# EAGLE design Logic Gates (EAGLE 9.6.2)
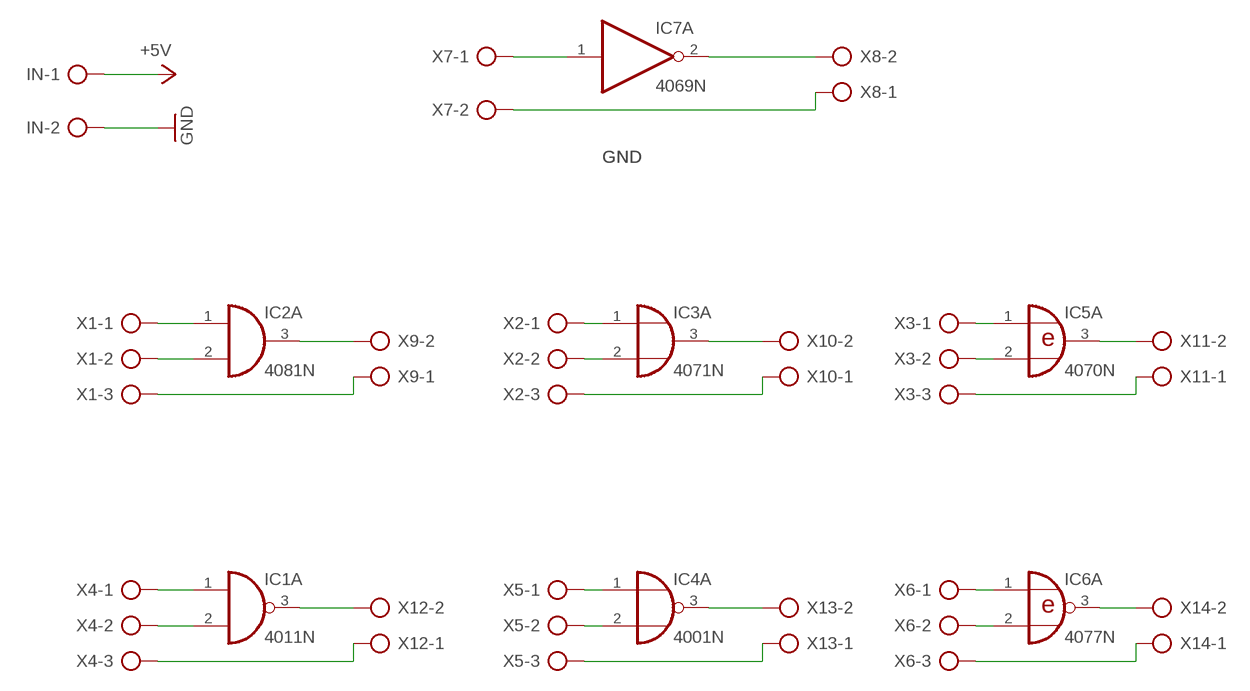
[diagram p0: schematic, sheet 1]

## Parts
IC1  4011N  [DIL14]
IC2  4081N  [DIL14]
IC3  4071N  [DIL14]
IC4  4001N  [DIL14]
IC5  4070N  [DIL14]
IC6  4077N  [DIL14]
IC7  4069N  [DIL14]
IN  AK300/2  [AK300/2]
X1  AK300/3  [AK300/3]
X2  AK300/3  [AK300/3]
X3  AK300/3  [AK300/3]
X4  AK300/3  [AK300/3]
X5  AK300/3  [AK300/3]
X6  AK300/3  [AK300/3]
X7  AK300/2  [AK300/2]
X8  AK300/2  [AK300/2]
X9  AK300/2  [AK300/2]
X10  AK300/2  [AK300/2]
X11  AK300/2  [AK300/2]
X12  AK300/2  [AK300/2]
X13  AK300/2  [AK300/2]
X14  AK300/2  [AK300/2]

## Nets
+5V: IN.1
GND: IN.2 X1.3 X2.3 X3.3 X4.3 X5.3 X6.3 X7.2 X8.1 X9.1 X10.1 X11.1 X12.1 X13.1 X14.1
N$1: IC7.1(A:I) X7.1
N$2: IC7.2(A:O) X8.2
N$4: IC2.1(A:I0) X1.1
N$5: IC2.3(A:O) X9.2
N$6: IC2.2(A:I1) X1.2
N$7: IC3.3(A:O) X10.2
N$8: IC5.3(A:O) X11.2
N$9: IC3.1(A:I0) X2.1
N$10: IC3.2(A:I1) X2.2
N$11: IC6.3(A:O) X14.2
N$12: IC4.3(A:O) X13.2
N$13: IC5.1(A:I0) X3.1
N$14: IC1.3(A:O) X12.2
N$15: IC5.2(A:I1) X3.2
N$18: IC1.1(A:I0) X4.1
N$19: IC1.2(A:I1) X4.2
N$22: IC4.1(A:I0) X5.1
N$23: IC4.2(A:I1) X5.2
N$25: IC6.1(A:I0) X6.1
N$26: IC6.2(A:I1) X6.2
Unconnected: IC1.4(B:O) IC1.5(B:I0) IC1.6(B:I1) IC1.8(C:I0) IC1.9(C:I1) IC1.10(C:O) IC1.11(D:O) IC1.12(D:I0) IC1.13(D:I1) IC2.4(B:O) IC2.5(B:I0) IC2.6(B:I1) IC2.8(C:I0) IC2.9(C:I1) IC2.10(C:O) IC2.11(D:O) IC2.12(D:I0) IC2.13(D:I1) IC3.4(B:O) IC3.5(B:I0) IC3.6(B:I1) IC3.8(C:I0) IC3.9(C:I1) IC3.10(C:O) IC3.11(D:O) IC3.12(D:I0) IC3.13(D:I1) IC4.4(B:O) IC4.5(B:I0) IC4.6(B:I1) IC4.8(C:I0) IC4.9(C:I1) IC4.10(C:O) IC4.11(D:O) IC4.12(D:I0) IC4.13(D:I1) IC5.4(B:O) IC5.5(B:I0) IC5.6(B:I1) IC5.8(C:I0) IC5.9(C:I1) IC5.10(C:O) IC5.11(D:O) IC5.12(D:I0) IC5.13(D:I1) IC6.4(B:O) IC6.5(B:I0) IC6.6(B:I1) IC6.8(C:I0) IC6.9(C:I1) IC6.10(C:O) IC6.11(D:O) IC6.12(D:I0) IC6.13(D:I1) IC7.3(B:I) IC7.4(B:O) IC7.5(C:I) IC7.6(C:O) IC7.8(D:O) IC7.9(D:I) IC7.10(E:O) IC7.11(E:I) IC7.12(F:O) IC7.13(F:I)

## Power pins joined to a net without a drawn wire
+5V: IC1.14(P:VDD) IC2.14(P:VDD) IC3.14(P:VDD) IC4.14(P:VDD) IC5.14(P:VDD) IC6.14(P:VDD) IC7.14(P:VDD)
GND: IC1.7(P:VSS) IC2.7(P:VSS) IC3.7(P:VSS) IC4.7(P:VSS) IC5.7(P:VSS) IC6.7(P:VSS) IC7.7(P:VSS)

## Library data of the parts
IC1 = 40xx:4011: Quad 2-input NAND
IC2 = 40xx:4081: Quad 2-input AND
IC3 = 40xx:4071: Quad 2-input OR
IC4 = 40xx:4001: Quad 2-input NOR
IC5 = 40xx:4070: Quad 2-input XOR
IC6 = 40xx:4077: Quad XNOR
IC7 = 40xx:4069: Hex INVERTER
IN X7-X14 = con-ptr500:AK300/2: CONNECTOR; OC_FARNELL: unknown; OC_NEWARK: unknown
X1-X6 = con-ptr500:AK300/3: CONNECTOR; OC_FARNELL: unknown; OC_NEWARK: unknown

## Board
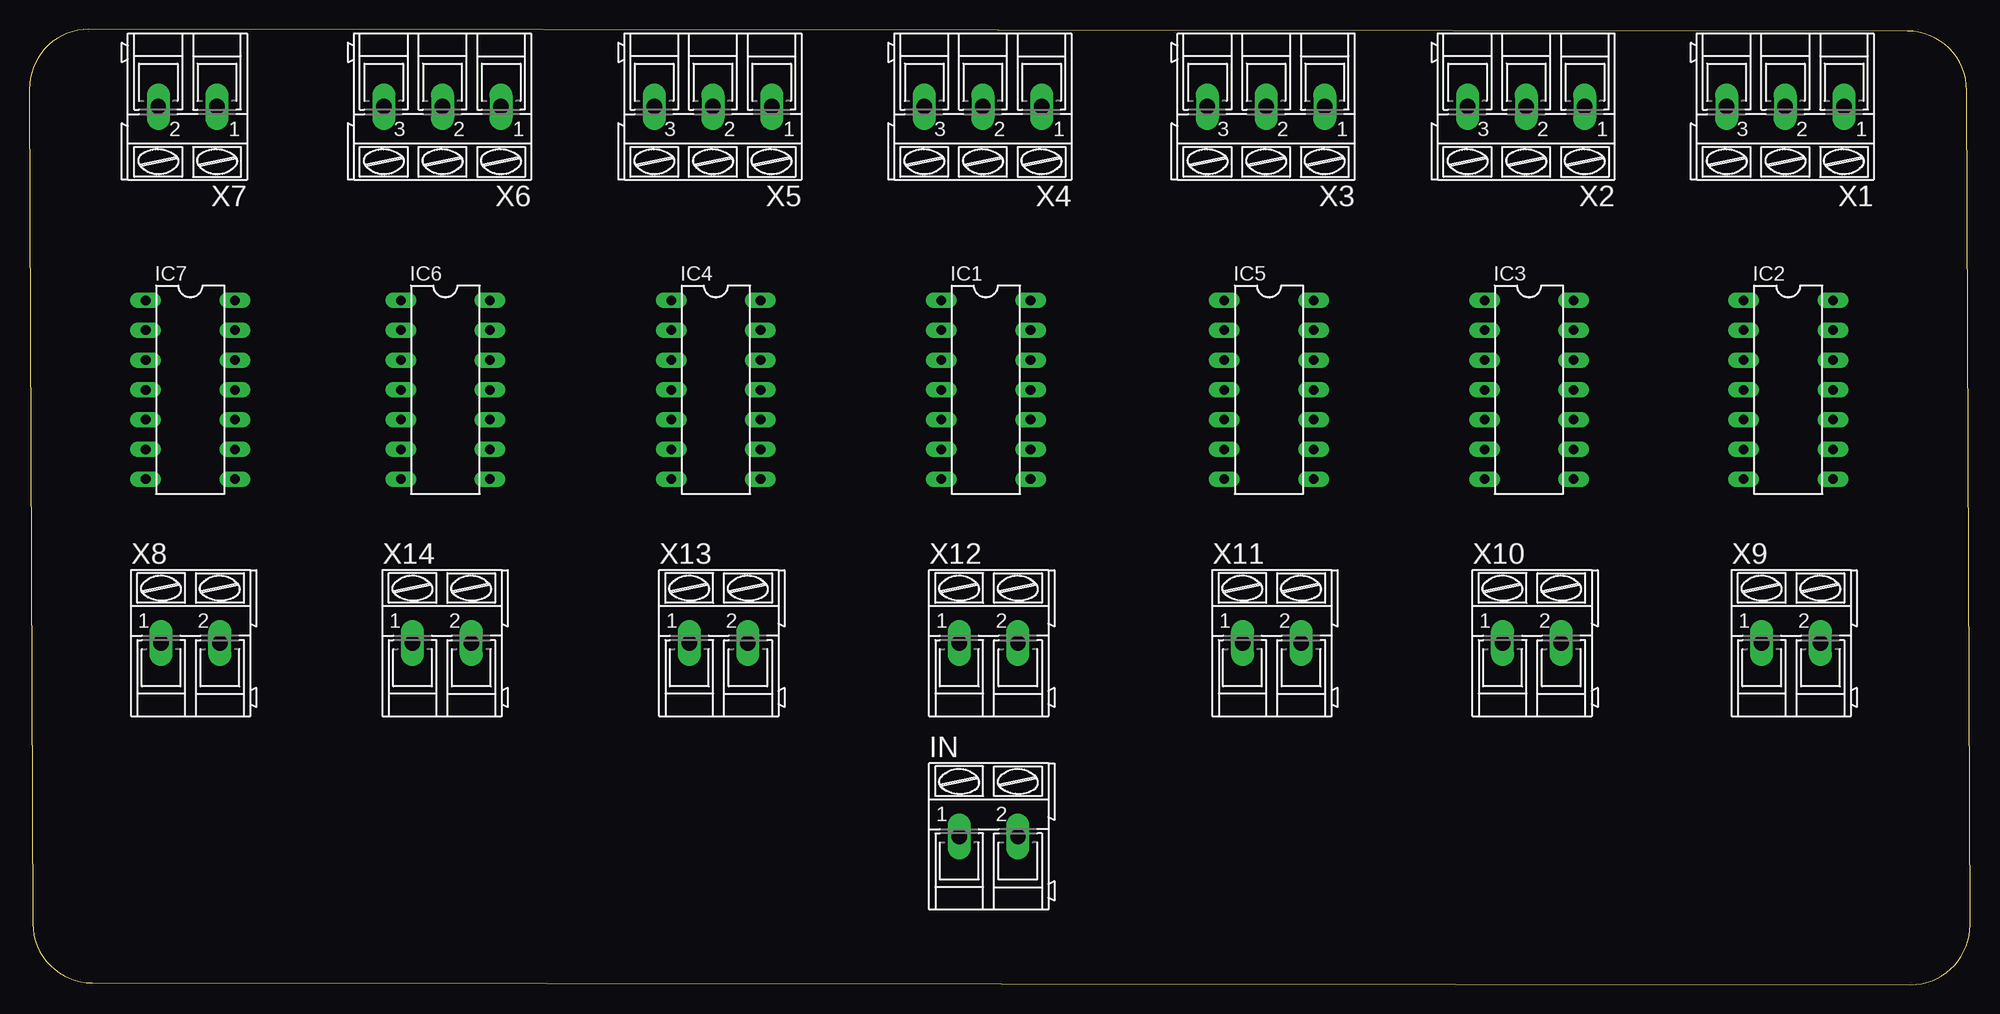
[diagram p1: board, top side]
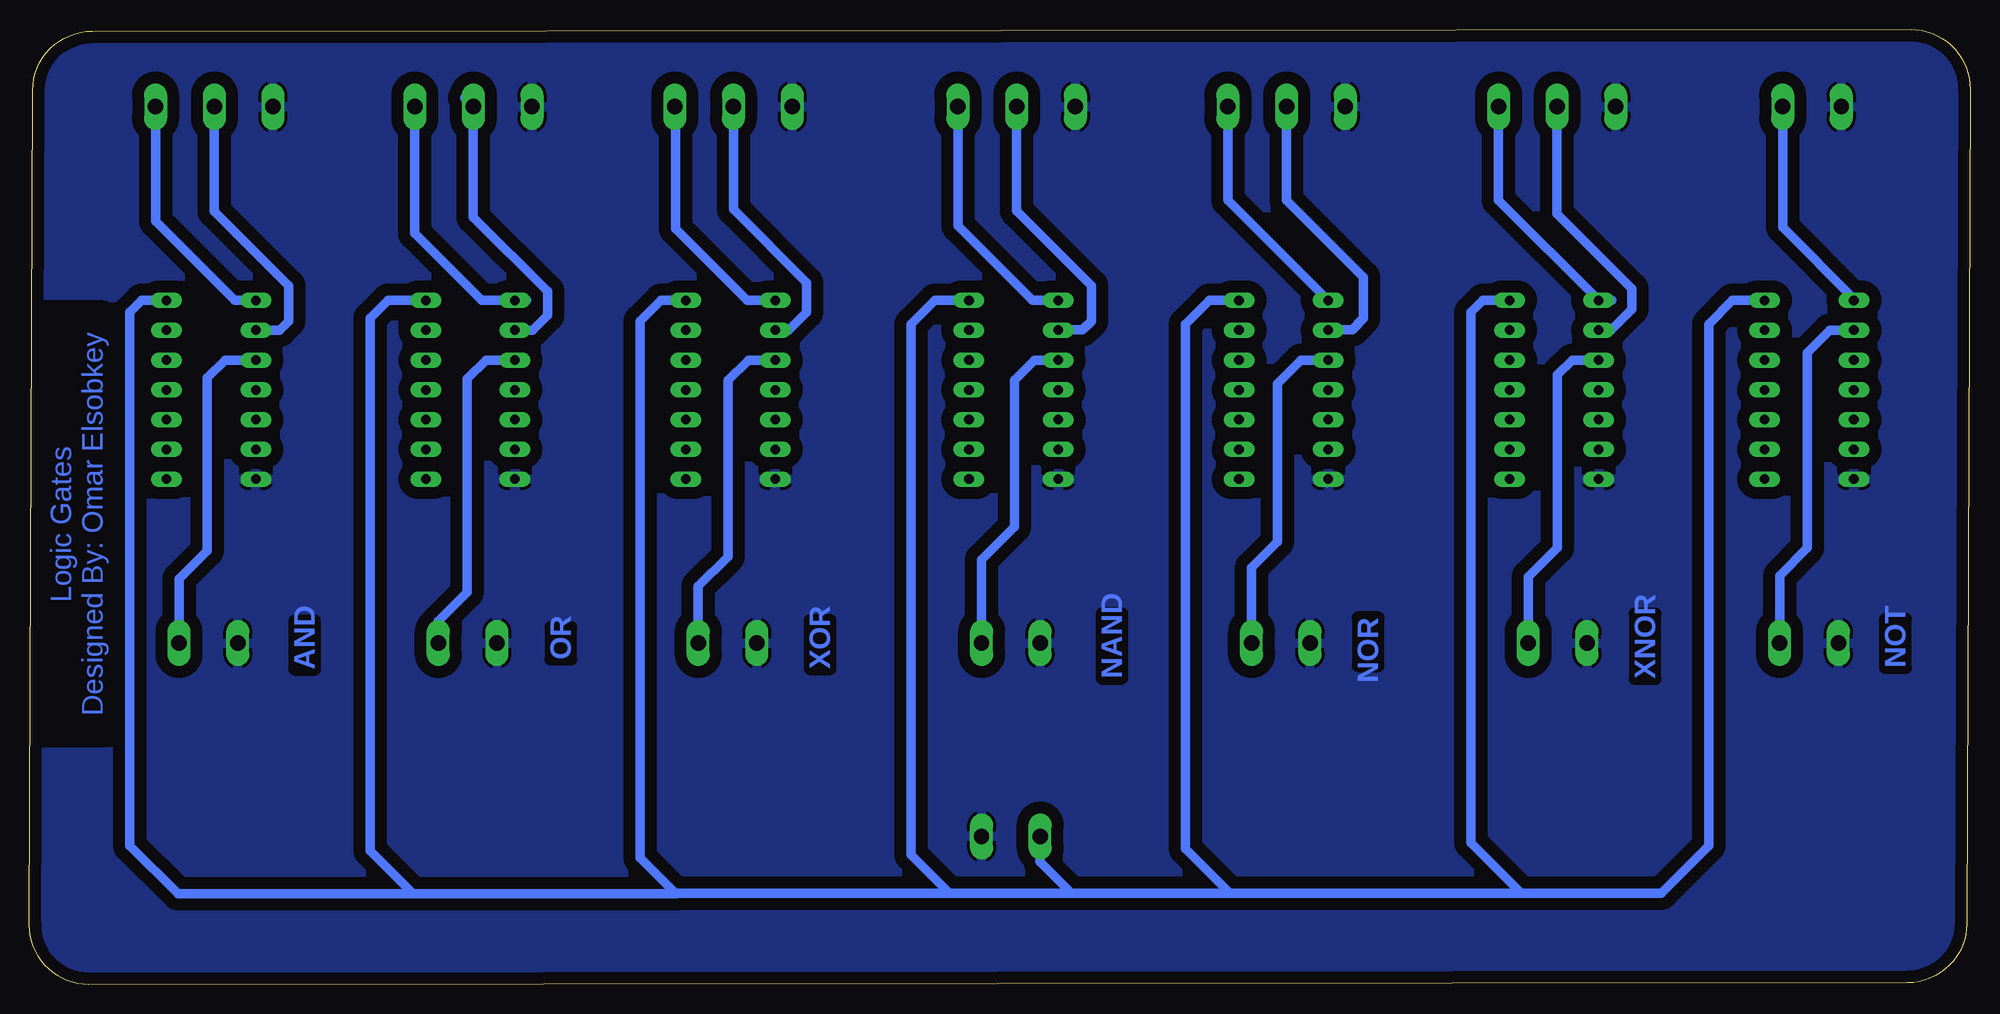
[diagram p2: board, bottom side, seen from below]

Size 165.49 x 81.43 mm. Coordinates in mm from the lower left corner, seen from the top.
Outline: 160.13,81.29 5.08,81.43 arc90 0,76.33 0.29,5.2 arc90 5.36,0.14 160.41,0 arc90 165.49,5.1 165.2,76.23 arc90 160.13,81.29
Copper layers (1*16): Top 0.035mm / dielectric 1.5mm / Bottom 0.035mm
Design rules "default *": minimum track width 32mil, minimum drill 0.35mm, track to track 16mil, track to pad 16mil, pad to pad 6mil, via to via 6mil, smd to smd 6mil, copper to edge 40mil, drill to drill 6mil, minimum pad ring 10mil, minimum via ring 8mil, stop-mask expansion 4mil, vias tented up to drill 0mil, thermal gap 10mil

### Footprints (pad centres in the part's own frame; a part is rotated, then mirrored left to right if it is on the bottom)
DIL14 = drill 0.813 long: 1 -7.62,-3.81; 2 -5.08,-3.81; 3 -2.54,-3.81; 4 0,-3.81; 5 2.54,-3.81; 6 5.08,-3.81; 7 7.62,-3.81; 8 7.62,3.81; 9 5.08,3.81; 10 2.54,3.81; 11 0,3.81; 12 -2.54,3.81; 13 -5.08,3.81; 14 -7.62,3.81
AK300/2 = drill 1.321 long: 1 -2.515,0; 2 2.489,0
AK300/3 = drill 1.321 long: 1 -5.004,0; 2 0,0; 3 5.004,0

### Placement (x,y rotation side)
IC1  81.56,50.7 270 top
IC2  149.98,50.7 270 top
IC3  127.88,50.7 270 top
IC4  58.54,50.7 270 top
IC5  105.71,50.7 270 top
IC6  35.48,50.7 270 top
IC7  13.73,50.7 270 top
IN  81.81,12.62 0 top
X1  149.72,74.83 180 top
X2  127.63,74.83 180 top
X3  105.45,74.83 180 top
X4  81.3,74.83 180 top
X5  58.28,74.83 180 top
X6  35.22,74.83 180 top
X7  13.48,74.83 180 top
X8  13.76,29.11 0 top
X9  150.23,29.11 0 top
X10  128.13,29.11 0 top
X11  105.96,29.11 0 top
X12  81.81,29.11 0 top
X13  58.79,29.11 0 top
X14  35.2,29.11 0 top

### Tracks (layer width: path | path; a pad name or v marks a point on that pad's centre or on a via)
+5V
  Bottom 0.813: 132.75,7.72 152.81,7.72 156.93,11.84 156.93,57.3 155.91,58.32 IC2.14 | 132.75,7.72 110.32,7.72 110.37,7.77 | 110.37,7.77 90.3,7.77 90.3,7.8 87.03,7.8 | 63.12,7.8 76.61,7.8 | 38.28,7.8 63.12,7.8 | 38.28,7.8 26.32,7.8 22.31,11.81 22.31,56.29 20.27,58.32 IC7.14 | 87.03,7.8 76.61,7.8 | IC5.14 111.64,58.32 113.42,56.54 113.42,10.82 110.37,7.77 | IC3.14 134.9,58.32 136.43,56.8 136.43,11.41 132.75,7.72 | IC1.14 88.27,58.32 90.3,56.29 90.3,11.08 87.03,7.8 | IN.1 79.3,10.48 76.61,7.8 | 63.12,7.8 66.91,11.58 66.91,56.29 64.88,58.32 IC4.14 | 38.28,7.8 42.58,12.09 42.58,57.3 41.56,58.32 IC6.14
GND
  Bottom 0.813: 54.83,42.77 IC4.7 | 101.95,42.77 IC5.7
  pour Bottom (isolate 1.016): 165.36,81.43 165.36,0.31 -0.3,0.31 -0.3,81.43
N$1
  Bottom 0.813: IC7.1 9.85,58.4 15.99,64.54 X7.1
N$2
  Bottom 0.813: IC7.2 11.96,55.78 13.87,53.86 13.87,37.24 16.25,34.86 X8.2
N$4
  Bottom 0.813: X1.1 154.73,65.07 147.98,58.32 IC2.1
N$5
  Bottom 0.813: IC2.3 148.8,53.24 150.32,51.72 150.32,36.98 152.72,34.58 X9.2
N$6
  Bottom 0.813: X1.2 149.73,65.94 143.38,59.59 143.38,56.54 144.14,55.78 IC2.2
N$7
  Bottom 0.813: IC3.3 126.56,53.24 128.17,51.63 128.17,33.43 130.62,30.98 X10.2
N$8
  Bottom 0.813: IC5.3 104.18,53.24 105.91,51.51 105.91,36.48 108.45,33.94 X11.2
N$9
  Bottom 0.813: 123.09,58.32 IC3.1 126.9,58.32 132.63,64.05 X2.1
N$10
  Bottom 0.813: 128.38,75.58 X2.2 127.63,65.39 121.32,59.08 121.32,57.05 122.59,55.78 IC3.2
N$11
  Bottom 0.813: IC6.3 33.94,53.24 35.21,51.97 35.21,37.24 37.69,34.76 X14.2
N$12
  Bottom 0.813: IC4.3 57.05,53.24 59.09,51.21 59.09,37.75 61.28,35.55 X13.2
N$13
  Bottom 0.813: 101.66,58.32 IC5.1 104.3,58.32 110.39,64.42 110.39,74.83 X3.1
N$14
  Bottom 0.813: IC1.3 79.78,53.24 81.51,51.51 81.51,39.02 84.3,36.22 X12.2
N$15
  Bottom 0.813: X3.2 105.45,66.08 99.22,59.84 99.22,57.3 100.74,55.78 IC5.2
N$18
  Bottom 0.813: 77.48,58.32 IC1.1 | X4.1 86.31,64.67 79.96,58.32 IC1.1 | 77.37,58.32 IC1.1
N$19
  Bottom 0.813: IC1.2 77.72,55.8 75.67,55.8 74.94,56.54 74.94,59.59 81.3,65.96 X4.2
N$22
  Bottom 0.813: 54.64,58.32 IC4.1 54.77,58.32 63.29,66.84 X5.1
N$23
  Bottom 0.813: IC4.2 54.74,55.83 52.68,55.83 51.72,56.8 51.72,60.3 58.29,66.86 X5.2
N$25
  Bottom 0.813: 30.56,58.32 IC6.1 40.23,66.88 X6.1
N$26
  Bottom 0.813: 31.69,55.75 IC6.2 30.64,55.78 28.86,57.56 28.86,59.34 35.22,65.7 X6.2 35.41,74.64
NAMES
  pour Bottom (isolate 0.508): 139.6,24.54 139.6,33.43 144.43,33.43 144.43,24.54
NAMES1
  pour Bottom (isolate 0.508): 117.76,24.54 117.76,33.43 122.59,33.43 122.59,24.54
NAMES2
  pour Bottom (isolate 0.508): 95.66,24.79 95.66,33.68 100.49,33.68 100.49,24.79
NAMES3
  pour Bottom (isolate 0.508): 70.77,24.54 70.77,33.43 75.6,33.43 75.6,24.54
NAMES4
  pour Bottom (isolate 0.508): 48.67,24.54 48.67,33.43 53.5,33.43 53.5,24.54
NAMES5
  pour Bottom (isolate 0.508): 25.05,24.79 25.05,33.68 29.88,33.68 29.88,24.79
NAMES6
  pour Bottom (isolate 0.508): 3.71,24.54 3.71,33.43 8.54,33.43 8.54,24.54

### Text on the board
Bottom: Logic Gates / Designed By: Omar Elsobkey | NOR | NOT | XOR | OR | XNOR | NAND | AND